# Altium schematic sheet [22] - SD CARD, SPI, FLASH, EEPROM,.SchDoc
size A2; DocumentNumber: 22; SheetNumber: 22; SheetTotal: 32
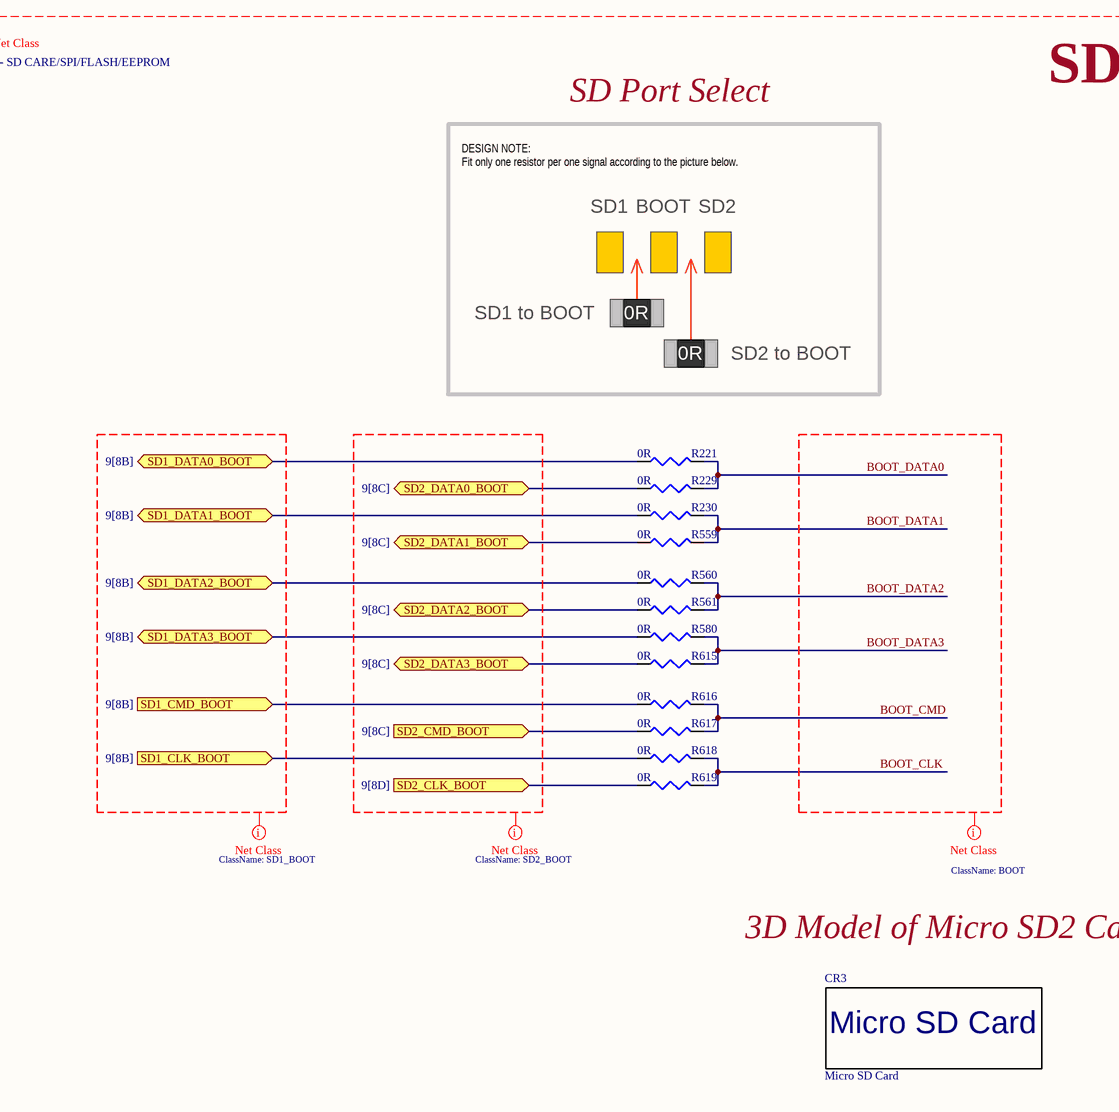
[diagram p0: [22] - SD CARD, SPI, FLASH, EEPROM,.SchDoc, top left]
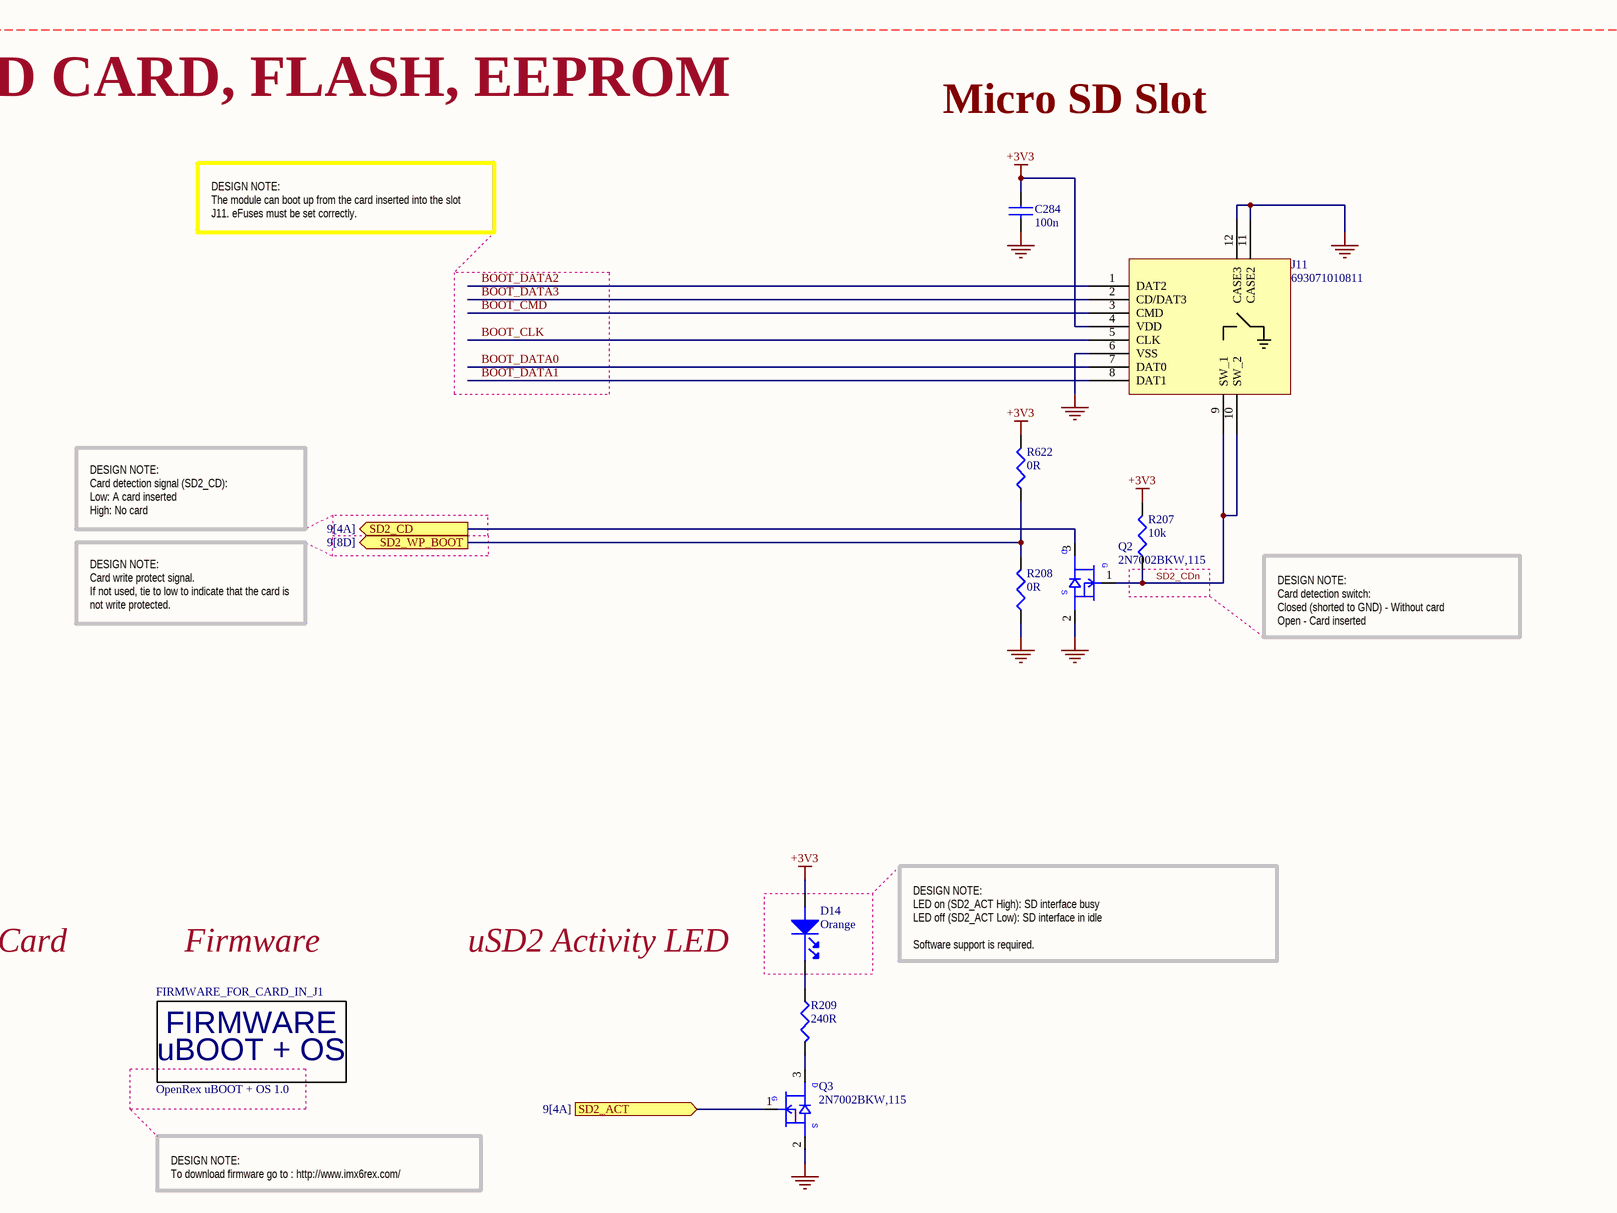
[diagram p1: [22] - SD CARD, SPI, FLASH, EEPROM,.SchDoc, top right]
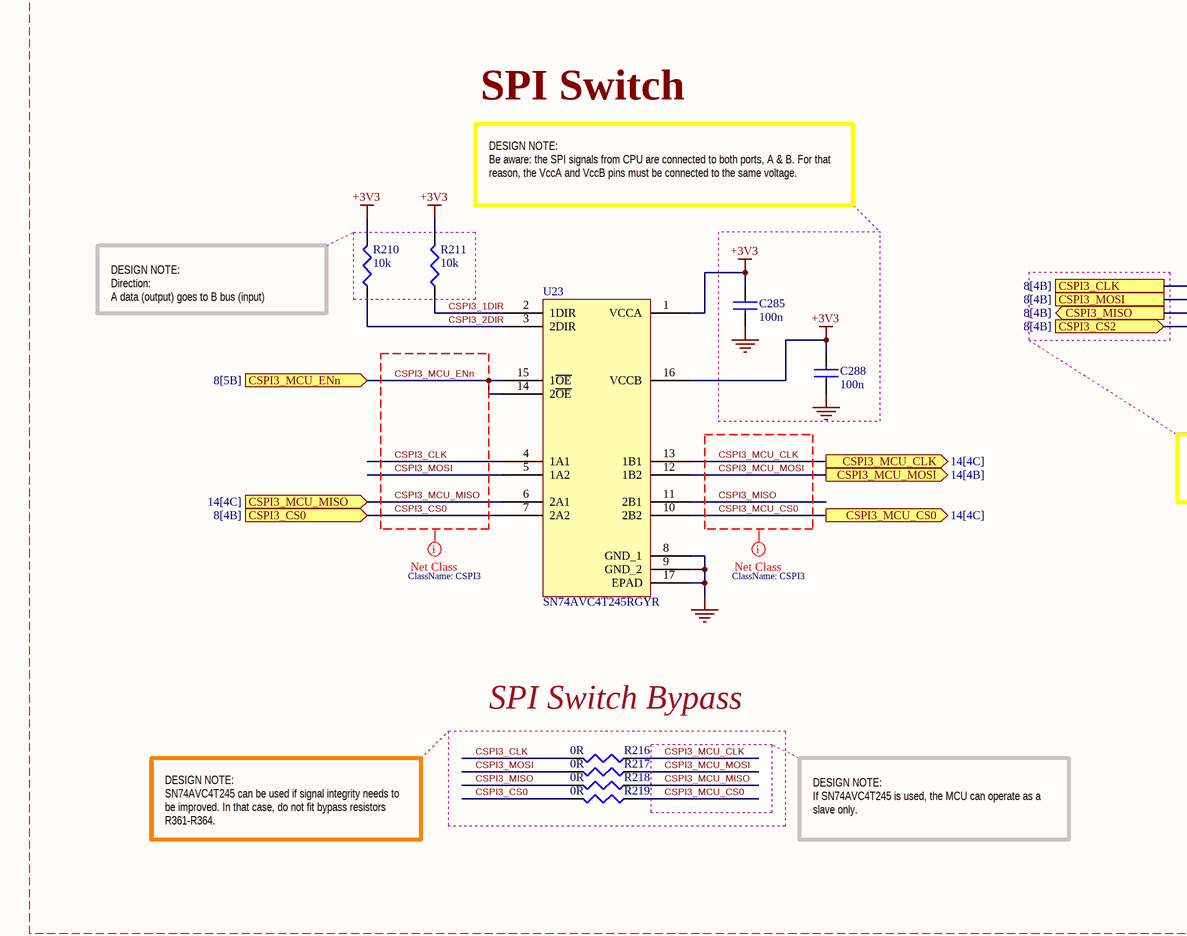
[diagram p2: [22] - SD CARD, SPI, FLASH, EEPROM,.SchDoc, bottom left]
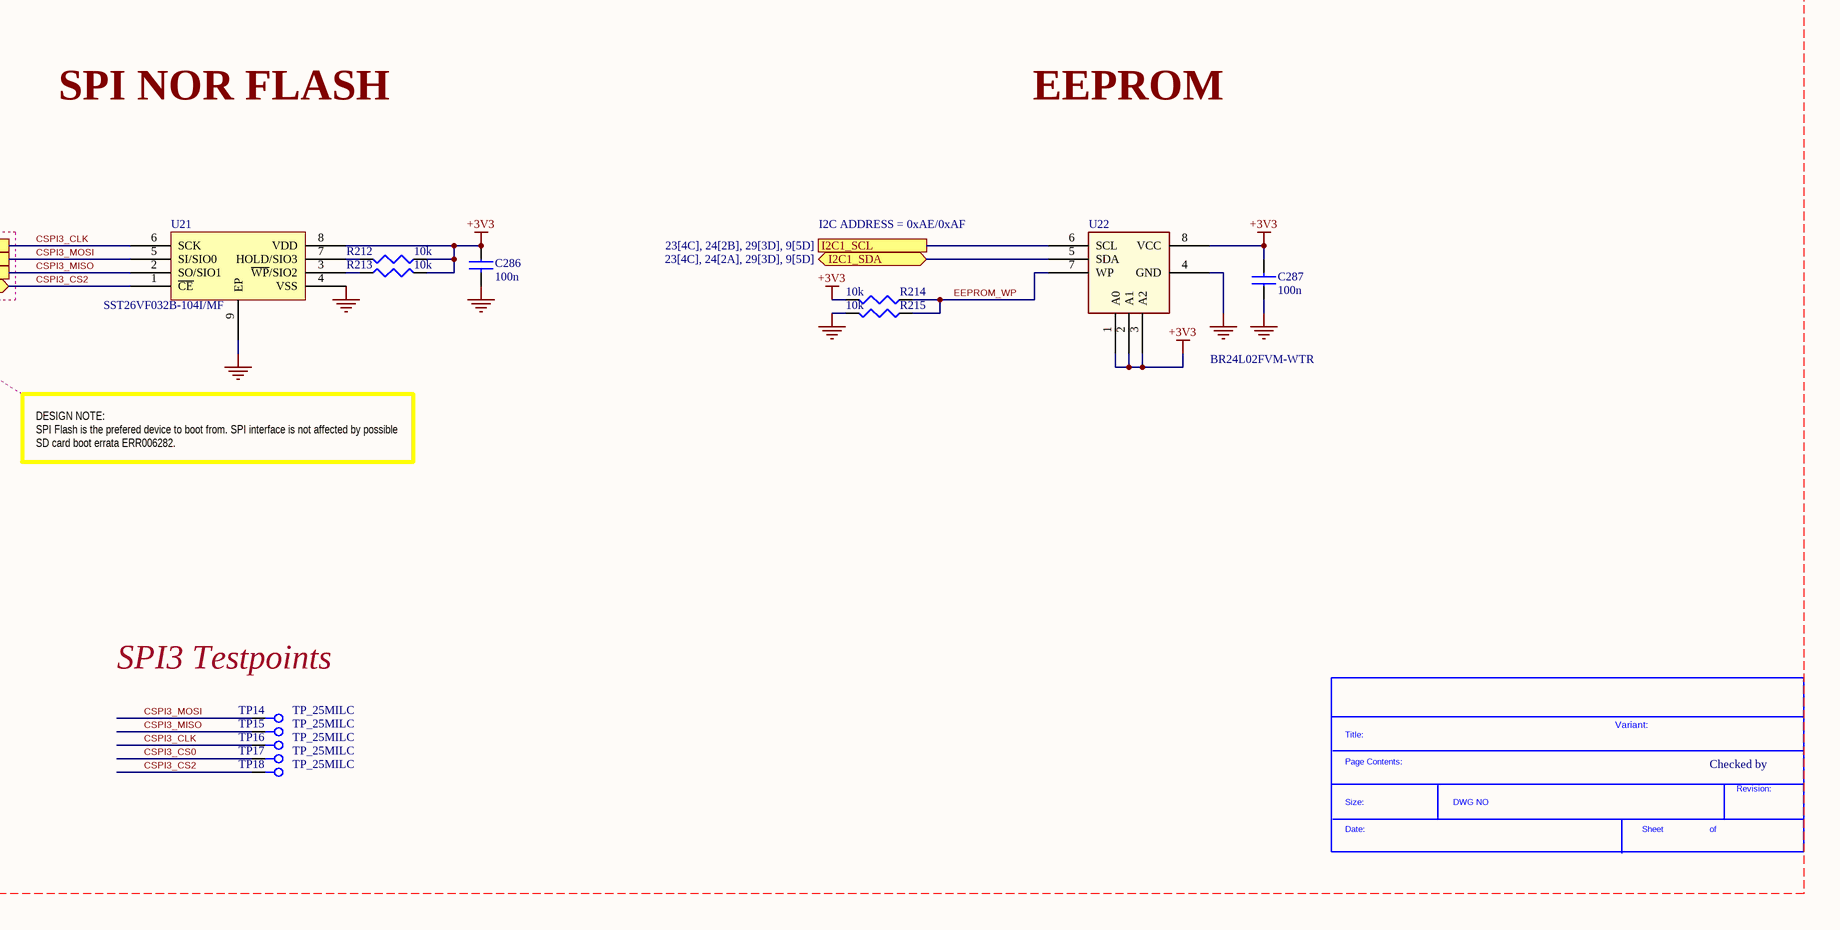
[diagram p3: [22] - SD CARD, SPI, FLASH, EEPROM,.SchDoc, bottom right]

## Parts
*  SDTitleBlock  (value not drawn)  (graphical)
C284  100n  [C0402]
C285  100n  [C0402]
C286  100n  [C0402]
C287  100n  [C0402]
C288  100n  [C0402]
CR3  Micro SD Card  [Micro_SD_card]  (no BOM)
D14  Orange  [LED_0603]
FIRMWARE_FOR_CARD_IN_J1  OpenRex uBOOT + OS 1.0  (mechanical)
J11  693071010811  [693071010811]
Q2  2N7002BKW,115  [SC70_SOT323]
Q3  2N7002BKW,115  [SC70_SOT323]
R207  10k  [R0402]
R208  0R  [R0402]
R209  240R  [R0402]
R210  10k  [R0402]
R211  10k  [R0402]
R212  10k  [R0402]
R213  10k  [R0402]
R214  10k  [R0402]
R215  10k  [R0402]
R216  0R  [R0402]
R217  0R  [R0402]
R218  0R  [R0402]
R219  0R  [R0402]
R221  0R  [R0402]
R229  0R  [R0402]
R230  0R  [R0402]
R559  0R  [R0402]
R560  0R  [R0402]
R561  0R  [R0402]
R580  0R  [R0402]
R615  0R  [R0402]
R616  0R  [R0402]
R617  0R  [R0402]
R618  0R  [R0402]
R619  0R  [R0402]
R622  0R  [R0402]
TP14  TP_25MILC  [TP_25C]  (no BOM)
TP15  TP_25MILC  [TP_25C]  (no BOM)
TP16  TP_25MILC  [TP_25C]  (no BOM)
TP17  TP_25MILC  [TP_25C]  (no BOM)
TP18  TP_25MILC  [TP_25C]  (no BOM)
U21  SST26VF032B-104I/MF  [WSON8_6X5MM]
U22  BR24L02FVM-WTR  [MSOP8 _SMALLER]
U23  SN74AVC4T245RGYR  [RGY (R-PVQFN-N16)]

## Blocks framed on the sheet
SPI Switch Bypass: R216-R219

## Ports
CSPI3_CLK (see 8[4B]), CSPI3_CS0 (in, see 8[4B]), CSPI3_CS2 (in, see 8[4B]), CSPI3_MCU_CLK (out, see 14[4C]), CSPI3_MCU_CS0 (out, see 14[4C]), CSPI3_MCU_ENn (in, see 8[5B]), CSPI3_MCU_MISO (in, see 14[4C]), CSPI3_MCU_MOSI (out, see 14[4B]), CSPI3_MISO (out, see 8[4B]), CSPI3_MOSI (see 8[4B]), I2C1_SCL (see 23[4C], 24[2B], 29[3D], 9[5D]), I2C1_SDA (bidir, see 23[4C], 24[2A], 29[3D], 9[5D]), SD1_CLK_BOOT (in, see 9[8B]), SD1_CMD_BOOT (in, see 9[8B]), SD1_DATA0_BOOT (bidir, see 9[8B]), SD1_DATA1_BOOT (bidir, see 9[8B]), SD1_DATA2_BOOT (bidir, see 9[8B]), SD1_DATA3_BOOT (bidir, see 9[8B]), SD2_ACT (in, see 9[4A]), SD2_CD (out, see 9[4A]), SD2_CLK_BOOT (in, see 9[8D]), SD2_CMD_BOOT (in, see 9[8C]), SD2_DATA0_BOOT (bidir, see 9[8C]), SD2_DATA1_BOOT (bidir, see 9[8C]), SD2_DATA2_BOOT (bidir, see 9[8C]), SD2_DATA3_BOOT (bidir, see 9[8C]), SD2_WP_BOOT (out, see 9[8D])

## Nets
+3V3: C284.1 C285.1 C286.1 C287.2 C288.1 D14.2(ANODE) J11.4(VDD) R207.2 R210.2 R211.2 R212.1 R213.2 R214.2 R622.2 U21.8(VDD) U22.1(A0) U22.2(A1) U22.3(A2) U22.8(VCC) U23.1(VCCA) U23.16(VCCB)
GND: C284.2 C285.2 C286.2 C287.1 C288.2 J11.6(VSS) J11.11(CASE2) J11.12(CASE3) Q2.2(SOURCE) Q3.2(SOURCE) R208.1 R215.2 U21.4(VSS) U21.9(EP) U22.4(GND) U23.8(GND_1) U23.9(GND_2) U23.17(EPAD)
BOOT_CLK: J11.5(CLK) R618.2 R619.2
BOOT_CMD: J11.3(CMD) R616.2 R617.2
BOOT_DATA0: J11.7(DAT0) R221.2 R229.2
BOOT_DATA1: J11.8(DAT1) R230.2 R559.2
BOOT_DATA2: J11.1(DAT2) R560.2 R561.2
BOOT_DATA3: J11.2(CD/DAT3) R580.2 R615.2
CSPI3_1DIR: R211.1 U23.2(1DIR)
CSPI3_2DIR: R210.1 U23.3(2DIR)
CSPI3_CLK: R216.2 TP16.1 U21.6(SCK) U23.4(1A1) ; port CSPI3_CLK
CSPI3_CS0: R219.2 TP17.1 U23.7(2A2) ; port CSPI3_CS0
CSPI3_CS2: TP18.1 U21.1(~{CE}) ; port CSPI3_CS2
CSPI3_MCU_CLK: R216.1 U23.13(1B1) ; port CSPI3_MCU_CLK
CSPI3_MCU_CS0: R219.1 U23.10(2B2) ; port CSPI3_MCU_CS0
CSPI3_MCU_ENn: U23.14(2~{OE}) U23.15(1~{OE}) ; port CSPI3_MCU_ENn
CSPI3_MCU_MISO: R218.1 U23.6(2A1) ; port CSPI3_MCU_MISO
CSPI3_MCU_MOSI: R217.1 U23.12(1B2) ; port CSPI3_MCU_MOSI
CSPI3_MISO: R218.2 TP15.1 U21.2(SO/SIO1) U23.11(2B1) ; port CSPI3_MISO
CSPI3_MOSI: R217.2 TP14.1 U21.5(SI/SIO0) U23.5(1A2) ; port CSPI3_MOSI
EEPROM_WP: R214.1 R215.1 U22.7(WP)
I2C1_SCL: U22.6(SCL) ; port I2C1_SCL
I2C1_SDA: U22.5(SDA) ; port I2C1_SDA
SD1_CLK_BOOT: R618.1 ; port SD1_CLK_BOOT
SD1_CMD_BOOT: R616.1 ; port SD1_CMD_BOOT
SD1_DATA0_BOOT: R221.1 ; port SD1_DATA0_BOOT
SD1_DATA1_BOOT: R230.1 ; port SD1_DATA1_BOOT
SD1_DATA2_BOOT: R560.1 ; port SD1_DATA2_BOOT
SD1_DATA3_BOOT: R580.1 ; port SD1_DATA3_BOOT
SD2_ACT: Q3.1(GATE) ; port SD2_ACT
SD2_CD: Q2.3(DRAIN) ; port SD2_CD
SD2_CDn: J11.9(SW_1) J11.10(SW_2) Q2.1(GATE) R207.1
SD2_CLK_BOOT: R619.1 ; port SD2_CLK_BOOT
SD2_CMD_BOOT: R617.1 ; port SD2_CMD_BOOT
SD2_DATA0_BOOT: R229.1 ; port SD2_DATA0_BOOT
SD2_DATA1_BOOT: R559.1 ; port SD2_DATA1_BOOT
SD2_DATA2_BOOT: R561.1 ; port SD2_DATA2_BOOT
SD2_DATA3_BOOT: R615.1 ; port SD2_DATA3_BOOT
SD2_WP_BOOT: R208.2 R622.1 ; port SD2_WP_BOOT
NetD14_1: D14.1(cathode) R209.1
NetQ3_3: Q3.3(DRAIN) R209.2
NetR212_2: R212.2 U21.7(HOLD/SIO3)
NetR213_1: R213.1 U21.3(~{WP}/SIO2)

## Layout directives
net class CSPI3: CSPI3_CLK, CSPI3_CS0, CSPI3_MCU_CLK, CSPI3_MCU_CS0, CSPI3_MCU_ENn, CSPI3_MCU_MISO, CSPI3_MCU_MOSI, CSPI3_MISO, CSPI3_MOSI
net class [22] - SD CARE/SPI/FLASH/EEPROM: +3V3, BOOT_CLK, BOOT_CMD, BOOT_DATA0, BOOT_DATA1, BOOT_DATA2, BOOT_DATA3, CSPI3_1DIR, CSPI3_2DIR, CSPI3_CLK, CSPI3_CS0, CSPI3_CS2, CSPI3_MCU_CLK, CSPI3_MCU_CS0, CSPI3_MCU_ENn, CSPI3_MCU_MISO, CSPI3_MCU_MOSI, CSPI3_MISO, CSPI3_MOSI, EEPROM_WP, GND, SD2_CDn
net class SD2_BOOT: +3V3, BOOT_CLK, BOOT_CMD, BOOT_DATA0, BOOT_DATA1, BOOT_DATA2, BOOT_DATA3, CSPI3_1DIR, CSPI3_2DIR, CSPI3_CLK, CSPI3_CS0, CSPI3_CS2, CSPI3_MCU_CLK, CSPI3_MCU_CS0, CSPI3_MCU_ENn, CSPI3_MCU_MISO, CSPI3_MCU_MOSI, CSPI3_MISO, CSPI3_MOSI, EEPROM_WP, GND, SD2_CDn
net class BOOT: +3V3, BOOT_CLK, BOOT_CMD, BOOT_DATA0, BOOT_DATA1, BOOT_DATA2, BOOT_DATA3, CSPI3_1DIR, CSPI3_2DIR, CSPI3_CLK, CSPI3_CS0, CSPI3_CS2, CSPI3_MCU_CLK, CSPI3_MCU_CS0, CSPI3_MCU_ENn, CSPI3_MCU_MISO, CSPI3_MCU_MOSI, CSPI3_MISO, CSPI3_MOSI, EEPROM_WP, GND, SD2_CDn
net class SD1_BOOT: +3V3, BOOT_CLK, BOOT_CMD, BOOT_DATA0, BOOT_DATA1, BOOT_DATA2, BOOT_DATA3, CSPI3_1DIR, CSPI3_2DIR, CSPI3_CLK, CSPI3_CS0, CSPI3_CS2, CSPI3_MCU_CLK, CSPI3_MCU_CS0, CSPI3_MCU_ENn, CSPI3_MCU_MISO, CSPI3_MCU_MOSI, CSPI3_MISO, CSPI3_MOSI, EEPROM_WP, GND, SD2_CDn

## Notes on the sheet
- SD CARD, FLASH, EEPROM
- SD Port Select
- Micro SD Slot
- DESIGN NOTE:
  Fit only one resistor per one signal according to the picture below.
- SD1
- BOOT
- SD2
- DESIGN NOTE:
  The module can boot up from the card inserted into the slot J11. eFuses must be set correctly.
- SD1 to BOOT
- 0R
- SD2 to BOOT
- DESIGN NOTE:
  Card detection signal (SD2_CD):
  Low: A card inserted
  High: No card
- DESIGN NOTE:
  Card write protect signal.
  If not used, tie to low to indicate that the card is not write protected.
- DESIGN NOTE:
  Card detection switch:
  Closed (shorted to GND) - Without card
  Open - Card inserted
- 3D Model of Micro SD2 Card
- Firmware
- uSD2 Activity LED
- DESIGN NOTE:
  LED on (SD2_ACT High): SD interface busy
  LED off (SD2_ACT Low): SD interface in idle
  Software support is required.
- DESIGN NOTE:
  To download firmware go to : http://www.imx6rex.com/
- SPI Switch
- SPI NOR FLASH
- EEPROM
- DESIGN NOTE:
  Be aware: the SPI signals from CPU are connected to both ports, A & B. For that reason, the VccA and VccB pins must be connected to the same voltage.
- I2C ADDRESS = 0xAE/0xAF
- DESIGN NOTE:
  Direction:
  A data (output) goes to B bus (input)
- DESIGN NOTE:
  SPI Flash is the prefered device to boot from. SPI interface is not affected by possible SD card boot errata ERR006282.
- SPI3 Testpoints
- Variant:
- Checked by
- DESIGN NOTE:
  SN74AVC4T245 can be used if signal integrity needs to be improved. In that case, do not fit bypass resistors R361-R364.
- DESIGN NOTE:
  If SN74AVC4T245 is used, the MCU can operate as a slave only.
- (in symbol 2N7002BKW,115) D; G; S
- (in symbol FIRMWARE_OpenRex_uBOOT_OS 1.0) FIRMWARE; uBOOT + OS
- (in symbol SDTitleBlock) Title:; Page Contents:; Revision:; Size:; DWG NO; Date:; Sheet; of

## Library data of the parts
C284-C288 = C1005X5R1H104K: CAP CER .10UF 50V X5R 10% 0402; Manufacturer: TDK Corporation; Capacitance: 0.1µF; Value: 100nF; .Checked PCB: used; Category: Capacitors; Supplier Part Number: 445-5942-1-ND; Manufacturer Part Number: C1005X5R1H104K; Operating Temperature: -55°C ~ 85°C; Package / Case: 0402 (1005 Metric); Price 1k [$]: 0.02340; .Checked SCH: used; Voltage - Rated: 50V; Supplier: Digikey; Supplier 1: Digi-Key; Supplier Part Number 1: 445-5942-1-ND; RoHS: RoHS Compliant; Stock 1: 106926; Pricing 1: 1=0.27, 10=0.18, 100=0.072, 250=0.05176, 500=0.0369, 1000=0.027 (USD); Tolerance: ±10%; Temperature Coefficient: X5R; Mounting Type: Surface Mount, MLCC; Applications: General Purpose; Ratings: -; Size / Dimension: 0.039" L x 0.020" W (1.00mm x 0.50mm); Height - Seated (Max): -; Thickness (Max): 0.022" (0.55mm); Lead Spacing: -; Features: -; Packaging: Cut Tape (CT); Lead Style: -; ComponentLink1URL: http://www.tdk.co.jp/tefe02/e412_c.pdf; ComponentLink1Description: http://www.tdk.co.jp/tefe02/e412_c.pdf; Supplier 2: Digi-Key; Supplier Part Number 2: 311-1697-6-ND
CR3 = Card_Micro_SD: Card Micro SD; .Creator: MM; .Checked PCB: used; Category: Card; .Checked SCH: used
D14 = LO L29K-H2K1-24-Z: LED SMARTLED ORANGE 606NM 0603; Manufacturer: OSRAM Opto Semiconductors Inc; Millicandela Rating: 6.3mcd; Voltage - Forward (Vf) Typ: 1.8V; Current - Test: 2mA; Wavelength - Peak: 610nm; Viewing Angle: 160°; Lens Type: Diffused; Lens Style/Size: Rectangle with Flat Top, 1.3mm x 0.8mm; Luminous Flux @ Current - Test: 25 mlm; .Checked PCB: used; Supplier 1: Digi-Key; Supplier Part Number 1: 475-2740-1-ND; Manufacturer Part Number: LO L29K-H2K1-24-Z; RoHS: RoHS Compliant; Category: Optoelectronics; Stock 1: 15900; Pricing 1: 1=0.17, 10=0.141, 100=0.1127, 250=0.0986, 500=0.09016 (USD); Color: Orange; Wavelength - Dominant: 606nm; Package / Case: 0603 (1608 Metric); Size / Dimension: 1.70mm L x 0.80mm W; Height: 0.65mm; Mounting Type: Surface Mount; Packaging: Cut Tape (CT); ComponentLink1URL: http://catalog.osram-os.com/catalogue/catalogue.do;jsessionid=302CF83AF637AE24E40AEB0ADA267EDD?act=downloadFile&favOid=020000010003f9de000100b6; ComponentLink1Description: http://catalog.osram-os.com/catalogue/catalogue.do;jsessionid=302CF83AF637AE24E40AEB0ADA267EDD?act=downloadFile&favOid=020000010003f9de000100b6; .Checked SCH: used
FIRMWARE_FOR_CARD_IN_J1 = FIRMWARE_OpenRex_uBOOT_OS 1.0: .Creator: MM; .Checked PCB: used; Category: Firmware; .Checked SCH: used
J11 = 693071010811: CONN MICRO SD 8 POS SMD; Manufacturer: Wurth Electronics Inc; Card Type: Secure Digital - microSD™; Number of Positions: 9 (8 + 1); Connector Type: Connector and Ejector; Insertion, Removal Method: Push In, Push Out; .Creator: MM; .Checked PCB: used; Supplier 1: Digi-Key; Manufacturer Part Number: 693071010811; RoHS: RoHS Compliant; Category: Connectors, Interconnects; Stock 1: 4877; Pricing 1: 1=3.32, 10=3.188, 50=2.805, 100=2.6775, 500=2.295, 1400=2.10375 (USD); Packaging: Cut Tape (CT); Ejector Side: -; Mounting Type: Surface Mount, Right Angle; Features: Switch; Height Above Board: 0.072" (1.83mm); Mounting Feature: Normal, Standard - Top; Contact Finish: Gold; Contact Finish Thickness: -; ComponentLink1URL: http://katalog.we-online.de/em/datasheet/693071010811.pdf; ComponentLink1Description: http://katalog.we-online.de/em/datasheet/693071010811.pdf; Supplier Part Number 1: 732-3819-1-ND; .Checked SCH: used
Q2 Q3 = 2N7002BKW,115: MOSFET N-CH 60V 310MA SOT323; Manufacturer: NXP Semiconductors; FET Type: MOSFET N-Channel, Metal Oxide; FET Feature: Logic Level Gate; Rds On (Max) @ Id, Vgs: 1.6 Ohm @ 500mA, 10V; Vgs(th) (Max) @ Id: 2.1V @ 250µA; Gate Charge (Qg) @ Vgs: 0.6nC @ 4.5V; Input Capacitance (Ciss) @ Vds: 50pF @ 10V; Power - Max: 275mW; .Checked PCB: used; Supplier 1: Digi-Key; Supplier Part Number 1: 1727-4788-1-ND; Manufacturer Part Number: 2N7002BKW,115; RoHS: RoHS Compliant; Category: Discrete Semiconductor Products; Drain to Source Voltage (Vdss): 60V; Current - Continuous Drain (Id) @ 25° C: 310mA; Mounting Type: Surface Mount; Package / Case: SC-70, SOT-323; Supplier Device Package: SC-70; Packaging: Cut Tape (CT); ComponentLink1URL: http://www.nxp.com/documents/data_sheet/2N7002BKW.pdf; ComponentLink1Description: http://www.nxp.com/documents/data_sheet/2N7002BKW.pdf; .Checked SCH: used
R207 R210-R215 = RC0402FR-0710KL: RES 10.0K OHM 1/16W 1% 0402 SMD; Manufacturer: Yageo; Power (Watts): 0.063W, 1/16W; .Checked PCB: used; Temperature Coefficient: ±100ppm/°C; Category: Resistors; Supplier Part Number: 311-10.0KLRCT-ND; Manufacturer Part Number: RC0402FR-0710KL; Package / Case: 0402 (1005 Metric); Price 1k [$]: 0.01421; Resistance (Ohms): 10K; Tolerance: ±1%; Value: 10k; .Checked SCH: used; Supplier: Digikey; Supplier 1: Digi-Key; Supplier Part Number 1: 311-10.0KLRCT-ND; RoHS: RoHS Compliant; Stock 1: 2916495; Pricing 1: 10=0.014, 50=0.0104, 100=0.0079, 250=0.00584, 500=0.00432, 1000=0.00288 (USD); Composition: Thick Film; Features: -; Size / Dimension: 0.039" L x 0.020" W (1.00mm x 0.50mm); Height: 0.016" (0.40mm); Number of Terminations: 2; Packaging: Cut Tape (CT); ComponentLink1URL: http://www.yageo.com/documents/recent/PYu-RC0402_51_RoHS_L_6.pdf; ComponentLink1Description: http://www.yageo.com/documents/recent/PYu-RC0402_51_RoHS_L_6.pdf
R208 R216-R219 R221 R229 R230 R559-R561 R580 R615-R619 R622 = RC0402JR-070RL: RES 0.0 OHM 1/16W 0402 SMD; Manufacturer: Yageo; Resistance (Ohms): 0.0; Power (Watts): 0.063W, 1/16W; Tolerance: Jumper; .Checked PCB: used; Category: Resistors; Supplier Part Number: 311-0.0JRCT-ND; Manufacturer Part Number: RC0402JR-070RL; Package / Case: 0402 (1005 Metric); Price 1k [$]: 0.01389; Value: 0R; .Checked SCH: used; Supplier: Digikey; Supplier 1: Digi-Key; Supplier Part Number 1: 311-0.0JRCT-ND; RoHS: RoHS Compliant; Stock 1: 1106330; Pricing 1: 10=0.012, 50=0.009, 100=0.0069, 250=0.00512, 500=0.0038, 1000=0.00253 (USD); Composition: Thick Film; Features: -; Temperature Coefficient: -; Size / Dimension: 0.039" L x 0.020" W (1.00mm x 0.50mm); Height: 0.016" (0.40mm); Number of Terminations: 2; Packaging: Cut Tape (CT); ComponentLink1URL: http://www.yageo.com/documents/recent/PYu-RC0402_51_RoHS_L_6.pdf; ComponentLink1Description: http://www.yageo.com/documents/recent/PYu-RC0402_51_RoHS_L_6.pdf
R209 = RMCF0402FT240R: RES TF 240 OHM 1% 0.0625W 0402; Manufacturer: Stackpole Electronics Inc; Resistance (Ohms): 240; Power (Watts): 0.063W, 1/16W; .Checked PCB: used; Temperature Coefficient: ±100ppm/°C; Category: Resistors; Supplier Part Number: RMCF0402FT240RCT-ND; Manufacturer Part Number: RMCF0402FT240R; Package / Case: 0402 (1005 Metric); Price 1k [$]: 0.00384; Tolerance: ±1%; Value: 240R; .Checked SCH: used; Supplier: Digikey; Supplier 1: Digi-Key; Supplier Part Number 1: RMCF0402FT240RCT-ND; RoHS: RoHS Compliant; Stock 1: 39860; Pricing 1: 1=0.04, 10=0.025, 50=0.0138, 100=0.0105, 250=0.0078, 500=0.00576, 1000=0.00384 (USD); Composition: Thick Film; Features: -; Size / Dimension: 0.039" L x 0.020" W (1.00mm x 0.50mm); Height: 0.016" (0.40mm); Number of Terminations: 2; Packaging: Cut Tape (CT); ComponentLink1URL: http://www.seielect.com/Catalog/SEI-RMCF.pdf; ComponentLink1Description: http://www.seielect.com/Catalog/SEI-RMCF.pdf
TP14-TP18 = TP_25MILC: Test Point 25mil; .Checked PCB: used
U21 = SST26VF032B-104I/MF: IC FLASH 32MBIT; Manufacturer: Microchip Technology; Memory Size: 32M (4M x 8); Speed: 104MHz; Interface: SQI, SPI; Voltage - Supply: 2.7 V ~ 3.6 V; .Creator: MM; .Checked SCH: used; Supplier 1: Digi-Key; Manufacturer Part Number: SST26VF032B-104I/MF; RoHS: RoHS Compliant; Category: Integrated Circuits (ICs); Stock 1: 417; Pricing 1: 1=1.68, 25=1.62, 100=1.56 (USD); Packaging: Tube; Format - Memory: FLASH; Memory Type: FLASH; Operating Temperature: -40°C ~ 85°C; Package / Case: 8-WDFN Exposed Pad; Supplier Device Package: 8-WDFN (5x6); ComponentLink1URL: http://www.microchip.com/mymicrochip/filehandler.aspx?ddocname=en566514; ComponentLink1Description: http://www.microchip.com/mymicrochip/filehandler.aspx?ddocname=en566514; Supplier Part Number 1: SST26VF032B-104I/MF-ND; .Checked PCB: used
U22 = BR24L02FVM-WTR: IC EEPROM 2KBIT 400KHZ 8MSOP; Manufacturer: Rohm Semiconductor; Format - Memory: EEPROMs - Serial; Memory Size: 2K (256 x 8); Interface: I²C, 2-Wire Serial; Voltage - Supply: 1.8 V ~ 5.5 V; .Checked PCB: used; Supplier 1: Digi-Key; Supplier Part Number 1: BR24L02FVM-WCT-ND; Manufacturer Part Number: BR24L02FVM-WTR; RoHS: RoHS Compliant; Category: Integrated Circuits (ICs); Stock 1: 19923; Pricing 1: 1=0.78, 25=0.602, 100=0.531, 250=0.4602, 500=0.3894, 1000=0.30975 (USD); Memory Type: EEPROM; Speed: 400kHz; Operating Temperature: -40°C ~ 85°C; Package / Case: 8-VSSOP, 8-MSOP (0.110", 2.80mm Width); Supplier Device Package: 8-MSOP; Packaging: Cut Tape (CT); ComponentLink1URL: http://www.rohm.com/products/databook/eeprom/pdf/br24l-e.pdf; ComponentLink1Description: http://www.rohm.com/products/databook/eeprom/pdf/br24l-e.pdf; .Checked SCH: used
U23 = SN74AVC4T245RGYR: IC BUS TRANSCVR 4BIT 16QFN; Manufacturer: Texas Instruments; Logic Function: Translator, Bidirectional, 3-State; Input Type: Voltage; Data Rate: 380Mbps; Number of Channels: 2; Differential - Input:Output: No/No; Propagation Delay (Max): 2.9ns; Voltage - Supply: 1.2 V ~ 3.6 V; .Creator: MM; .Checked PCB: used; Supplier 1: Digi-Key; Manufacturer Part Number: SN74AVC4T245RGYR; RoHS: RoHS Compliant; Category: Integrated Circuits (ICs); Stock 1: 17293; Pricing 1: 1=1.15, 10=0.924, 100=0.71, 500=0.548, 1000=0.495 (USD); Packaging: Cut Tape (CT); Output Type: Voltage; Number of Outputs/Channel: 2; Operating Temperature: -40°C ~ 85°C; Package / Case: 16-VFQFN Exposed Pad; Supplier Device Package: 16-VQFN (4x4); Mounting Type: Surface Mount; ComponentLink1URL: http://www.ti.com/lit/ds/symlink/sn74avc4t245.pdf; ComponentLink1Description: http://www.ti.com/lit/ds/symlink/sn74avc4t245.pdf; Supplier Part Number 1: 296-18231-1-ND; .Checked SCH: used